# EAGLE design VIC20_HypExp (EAGLE 9.6.2)
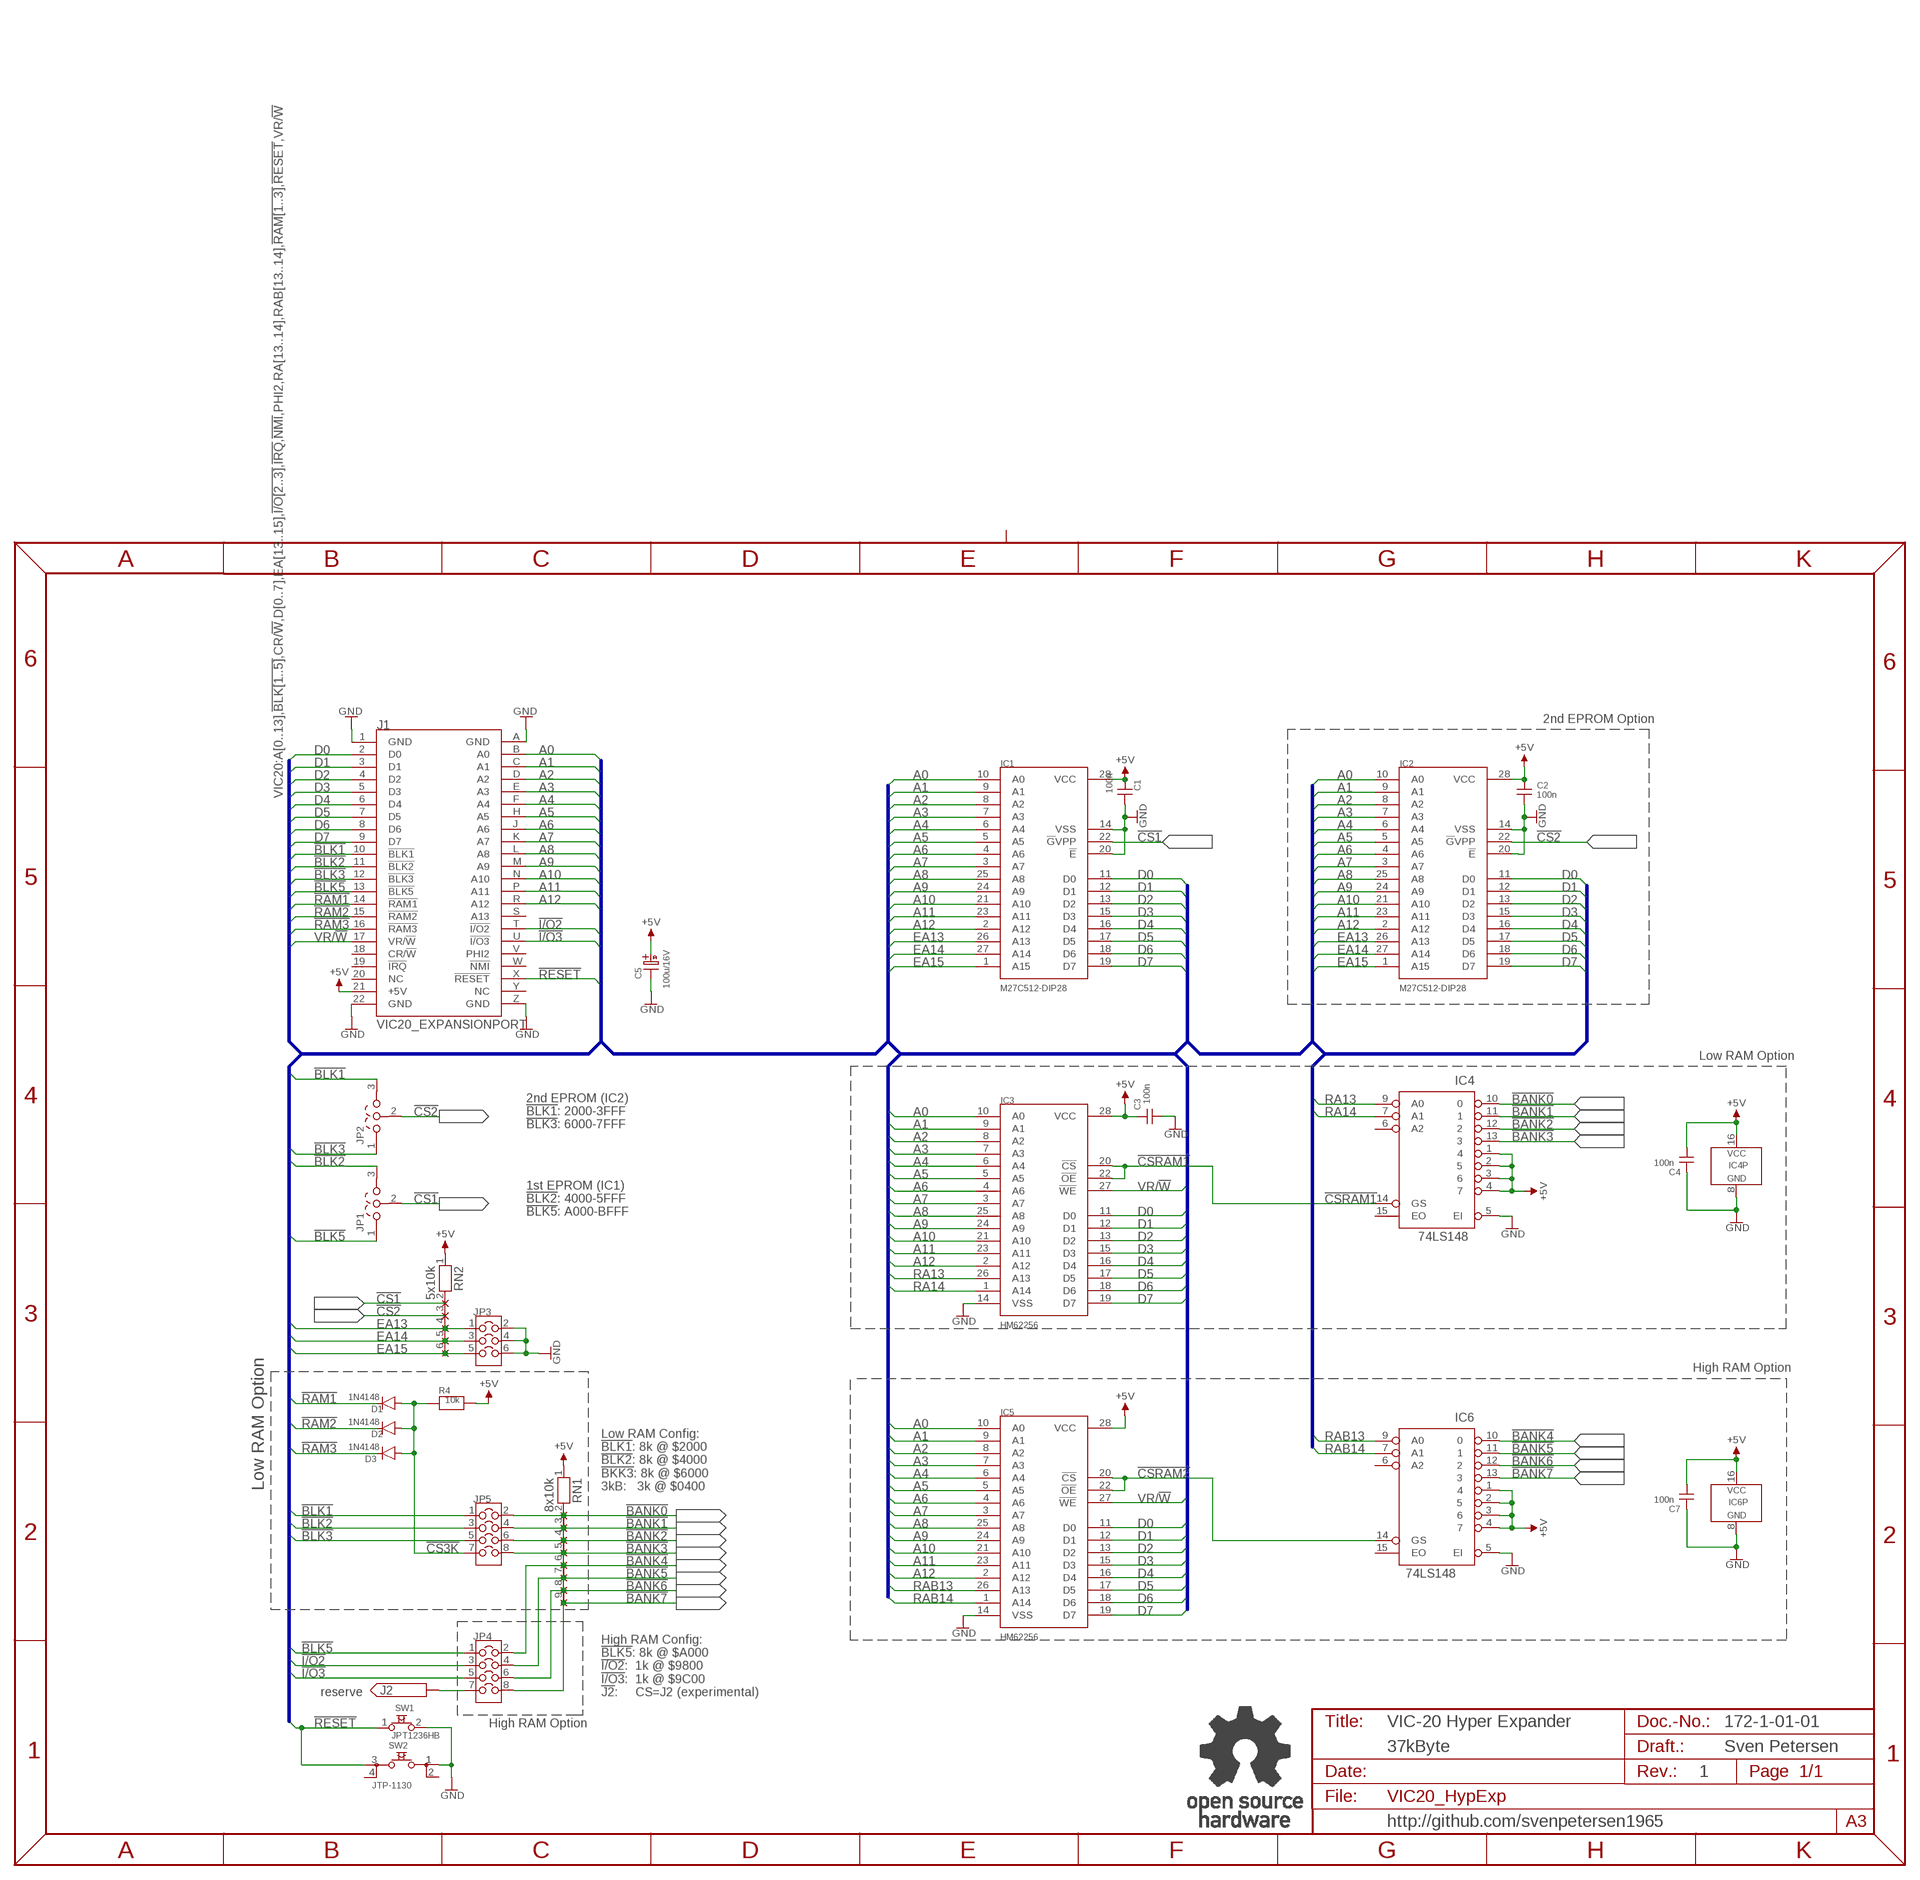
[diagram p0: schematic, sheet 1]

## Parts
C1  100n  CAP01  [C-2,5]
C2  100n  CAP01  [C-2,5]
C3  100n  CAP01  [C-2,5]
C4  100n  CAP01  [C-2,5]
C5  100u/16V  C07/2,5  [C07/2,5]
C7  100n  CAP01  [C-2,5]
D1  1N4148  1N41480.3"  [DO-35/3]
D2  1N4148  1N41480.3"  [DO-35/3]
D3  1N4148  1N41480.3"  [DO-35/3]
IC1  M27C512-DIP28  [DIL28-6]
IC2  M27C512-DIP28  [DIL28-6]
IC3  HM62256  [DIL28-6]
IC4  74LS148  74148DIL  [DIL-16]
IC5  HM62256  [DIL28-6]
IC6  74LS148  74148DIL  [DIL-16]
J1  VIC20_EXPANSIONPORT  [VIC20_EXPANSION]
J2  PINHD-1X1  [1X01]
JP1  COMBI-3P  [COMBI-3P]
JP2  COMBI-3P  [COMBI-3P]
JP3  COMBI-3X2P  [COMBI-3X2]
JP4  COMBI-4X2P  [COMBI-4X2]
JP5  COMBI-4X2P  [COMBI-4X2]
R4  10k  RES04  [R-10]
RN1  8x10k  RN08  [RN-9]
RN2  5x10k  RN05  [RN-6]
SW1  JPT1236HB  [JTP_1236HB]
SW2  JTP-1130  [JTP-1130]
U$2  OPEN_SOURCE_HW  [OPENHW]

## Nets
!BANK0: IC4.10 JP5.2 RN1.2
!BANK1: IC4.11 JP5.4 RN1.3
!BANK2: IC4.12 JP5.6 RN1.4
!BANK3: IC4.13 JP5.8 RN1.5
!BANK4: IC6.10 JP4.2 RN1.6
!BANK5: IC6.11 JP4.4 RN1.7
!BANK6: IC6.12 JP4.6 RN1.8
!BANK7: IC6.13 JP4.8 RN1.9
!BLK1: J1.10(!BLK1) JP2.3 JP5.1
!BLK2: J1.11(!BLK2) JP1.3 JP5.3
!BLK3: J1.12(!BLK3) JP2.1 JP5.5
!BLK5: J1.13(!BLK5) JP1.1 JP4.1
!CS1: IC1.22(!G!VPP) JP1.2 RN2.2
!CS2: IC2.22(!G!VPP) JP2.2 RN2.3
!CS3K: D1.A D2.A D3.A JP5.7 R4.1
!CSRAM1: IC3.20(!CS) IC3.22(!OE) IC4.14(GS)
!CSRAM2: IC5.20(!CS) IC5.22(!OE) IC6.14(GS)
!I/O2: J1.T(!I/O2) JP4.3
!I/O3: J1.U(!I/O3) JP4.5
!RAM1: D1.K J1.14(!RAM1)
!RAM2: D2.K J1.15(!RAM2)
!RAM3: D3.K J1.16(!RAM3)
!RESET: J1.X(!RESET) SW1.1 SW2.3
+5V: C1.1 C2.1 C3.2 C4.1 C5.A(+) C7.1 IC1.28(VCC) IC2.28(VCC) IC3.28(VCC) IC4.1 IC4.2 IC4.3 IC4.4 IC4.16(VCC) IC5.28(VCC) IC6.1 IC6.2 IC6.3 IC6.4 IC6.16(VCC) J1.21(+5V) R4.2 RN1.1 RN2.1
A0: IC1.10(A0) IC2.10(A0) IC3.10(A0) IC5.10(A0) J1.B(A0)
A1: IC1.9(A1) IC2.9(A1) IC3.9(A1) IC5.9(A1) J1.C(A1)
A2: IC1.8(A2) IC2.8(A2) IC3.8(A2) IC5.8(A2) J1.D(A2)
A3: IC1.7(A3) IC2.7(A3) IC3.7(A3) IC5.7(A3) J1.E(A3)
A4: IC1.6(A4) IC2.6(A4) IC3.6(A4) IC5.6(A4) J1.F(A4)
A5: IC1.5(A5) IC2.5(A5) IC3.5(A5) IC5.5(A5) J1.H(A5)
A6: IC1.4(A6) IC2.4(A6) IC3.4(A6) IC5.4(A6) J1.J(A6)
A7: IC1.3(A7) IC2.3(A7) IC3.3(A7) IC5.3(A7) J1.K(A7)
A8: IC1.25(A8) IC2.25(A8) IC3.25(A8) IC5.25(A8) J1.L(A8)
A9: IC1.24(A9) IC2.24(A9) IC3.24(A9) IC5.24(A9) J1.M(A9)
A10: IC1.21(A10) IC2.21(A10) IC3.21(A10) IC5.21(A10) J1.N(A10)
A11: IC1.23(A11) IC2.23(A11) IC3.23(A11) IC5.23(A11) J1.P(A11)
A12: IC1.2(A12) IC2.2(A12) IC3.2(A12) IC5.2(A12) J1.R(A12)
D0: IC1.11(D0) IC2.11(D0) IC3.11(D0) IC5.11(D0) J1.2(D0)
D1: IC1.12(D1) IC2.12(D1) IC3.12(D1) IC5.12(D1) J1.3(D1)
D2: IC1.13(D2) IC2.13(D2) IC3.13(D2) IC5.13(D2) J1.4(D2)
D3: IC1.15(D3) IC2.15(D3) IC3.15(D3) IC5.15(D3) J1.5(D3)
D4: IC1.16(D4) IC2.16(D4) IC3.16(D4) IC5.16(D4) J1.6(D4)
D5: IC1.17(D5) IC2.17(D5) IC3.17(D5) IC5.17(D5) J1.7(D5)
D6: IC1.18(D6) IC2.18(D6) IC3.18(D6) IC5.18(D6) J1.8(D6)
D7: IC1.19(D7) IC2.19(D7) IC3.19(D7) IC5.19(D7) J1.9(D7)
EA13: IC1.26(A13) IC2.26(A13) JP3.1 RN2.4
EA14: IC1.27(A14) IC2.27(A14) JP3.3 RN2.5
EA15: IC1.1(A15) IC2.1(A15) JP3.5 RN2.6
GND: C1.2 C2.2 C3.1 C4.2 C5.K(-) C7.2 IC1.14(VSS) IC1.20(!E) IC2.14(VSS) IC2.20(!E) IC3.14(VSS) IC4.5(EI) IC4.8(GND) IC5.14(VSS) IC6.5(EI) IC6.8(GND) J1.1(GND) J1.22(GND) J1.A(GND) J1.Z(GND) JP3.2 JP3.4 JP3.6 SW1.2 SW2.1
N$1: J2.1 JP4.7
RA13: IC3.26(A13) IC4.9(A0)
RA14: IC3.1(A14) IC4.7(A1)
RAB13: IC5.26(A13) IC6.9(A0)
RAB14: IC5.1(A14) IC6.7(A1)
VR/!W: IC3.27(!WE) IC5.27(!WE) J1.17(VR/!W)
Unconnected: IC4.6(A2) IC4.15(EO) IC6.6(A2) IC6.15(EO) J1.18(CR/!W) J1.19(!IRQ) J1.S(A13) J1.V(PHI2) J1.W(!NMI) J1.Y(NC) SW2.2 SW2.4

## Buses
VIC20:A[0..13],!BLK[1..5],CR/!W,D[0..7],EA[13..15],!I/O[2..3],!IRQ,!NMI,PHI2,RA[13..14],RAB[13..14],!RAM[1..3],!RESET,VR/!W

## Notes on the sheet
- 2nd EPROM Option
- Low RAM Option
- 2nd EPROM (IC2)
  !BLK1!: 2000-3FFF
  !BLK3!: 6000-7FFF
- 1st EPROM (IC1)
  !BLK2!: 4000-5FFF
  !BLK5!: A000-BFFF
- High RAM Option
- Low RAM Option
- Low RAM Config:
  !BLK1!: 8k @ $2000
  !BLK2!: 8k @ $4000
  !BKK3!: 8k @ $6000
  3kB:   3k @ $0400
- reserve
- High RAM Config:
  !BLK5!: 8k @ $A000
  !I/O2!:  1k @ $9800
  !I/O3!:  1k @ $9C00
  !J2!:     CS=J2 (experimental)
- High RAM Option | VIC-20 Hyper Expander | 172-1-01-01
- 37kByte | Sven Petersen
- 1
- http://github.com/svenpetersen1965

## Power pins joined to a net without a drawn wire
NC: J1.20(NC)

## Library data of the parts
C1-C4 C7 = DISCRETE:CAP01
C5 = ELCO:C07/2,5
D1-D3 = Dioden:1N4148
IC1 IC2 = ST:M27C512
IC3 IC5 = Hitachi:HM62256
IC4 IC6 = 74XX:74148
J1 = Commodore:VIC20_EXPANSIONPORT
J2 = PINHEAD:PINHD-1X1
JP1 JP2 = Cutpad:COMBI-3P
JP3 = Cutpad:COMBI-3X2P
JP4 JP5 = Cutpad:COMBI-4X2P
R4 = DISCRETE:RES04
RN1 = DISCRETE:RN08
RN2 = DISCRETE:RN05
SW1 = Namae_Electronics:JPT1236HB
SW2 = Namae_Electronics:JTP-1130
U$2 = Logo:OPEN_SOURCE_HW

## Board
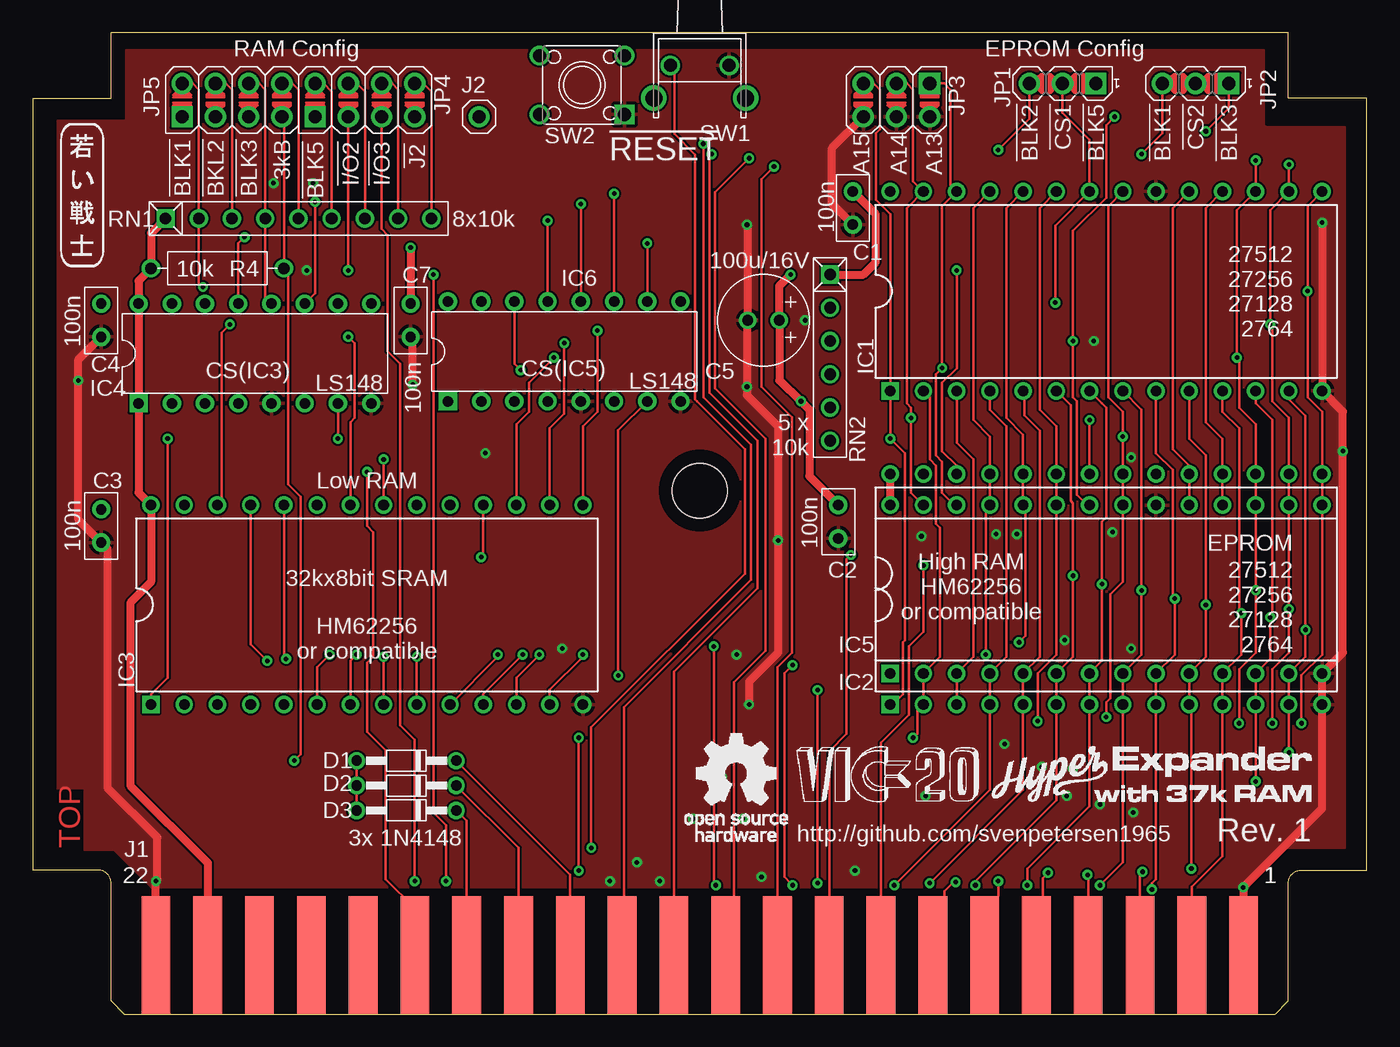
[diagram p1: board, top side]
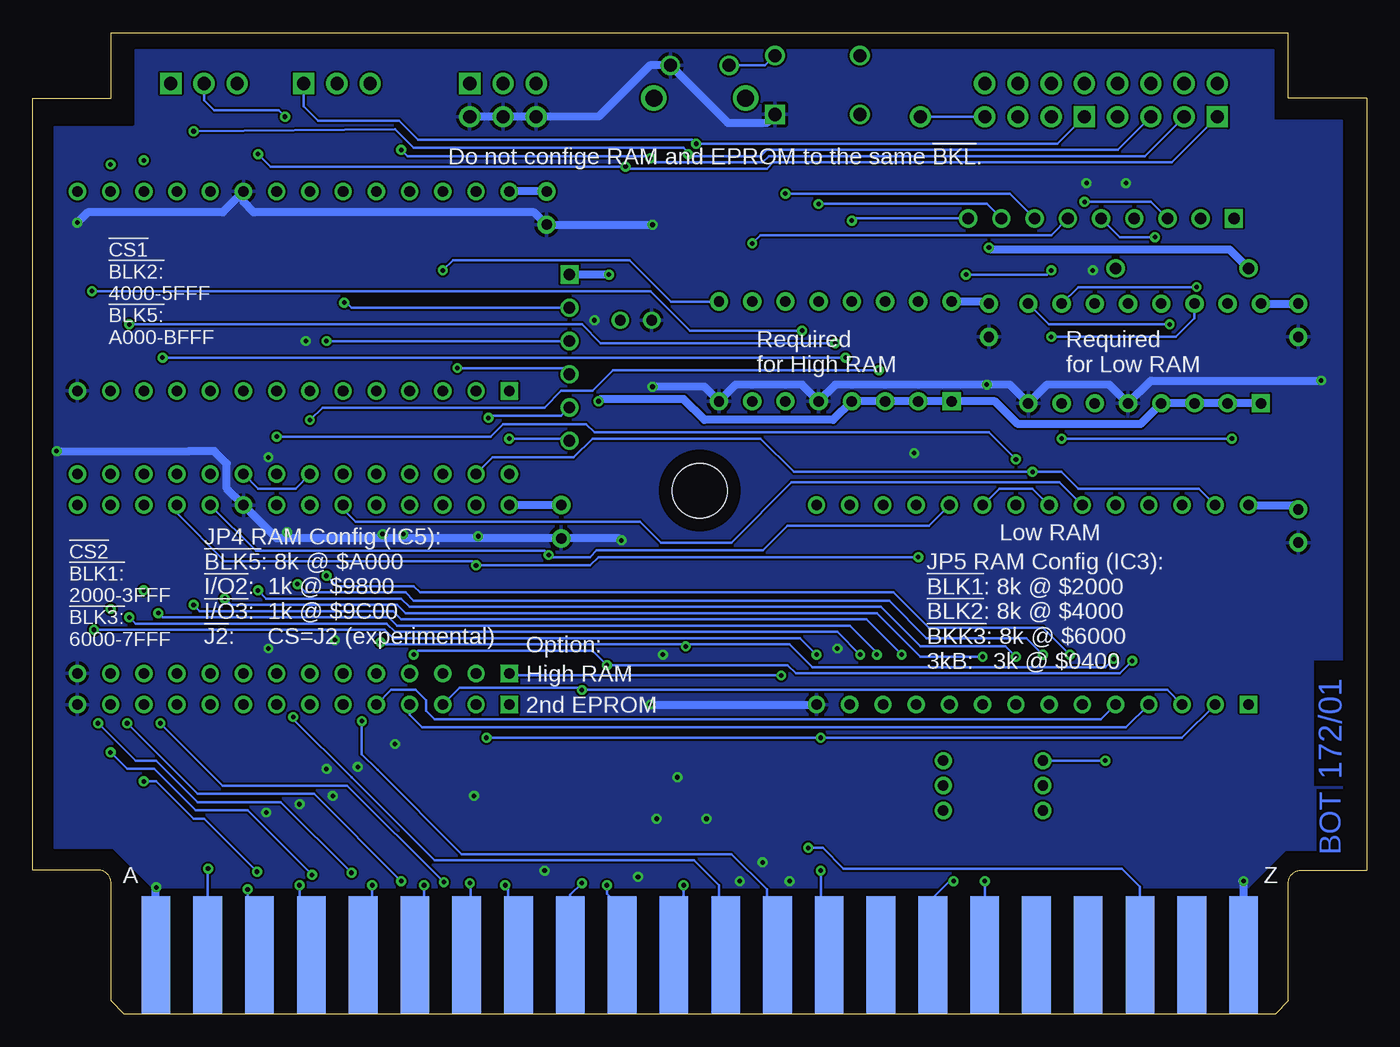
[diagram p2: board, bottom side, seen from below]

Size 102 x 75 mm. Coordinates in mm from the lower left corner, seen from the top.
Outline: 102,11 102,70 96,70 96,75 6,75 6,70 0,70 0,11
Copper layers (1*16): Top 0.035mm / dielectric 1.5mm / Bottom 0.035mm
Design rules "default *": minimum track width 6mil, minimum drill 0.35mm, track to track 6mil, track to pad 6mil, pad to pad 6mil, via to via 6mil, smd to smd 6mil, copper to edge 40mil, drill to drill 6mil, minimum pad ring 10mil, minimum via ring 8mil, stop-mask expansion 4mil, vias tented up to drill 23mil, thermal gap 10mil
Holes 4.2 mm at 51,40
bRestrict: 3 lines

### Footprints (pad centres in the part's own frame; a part is rotated, then mirrored left to right if it is on the bottom)
C-2,5 = drill 0.8 pad 1.397: 1 -1.27,0; 2 1.27,0
C07/2,5 = drill 0.813 pad 1.27: A -1.202,0; K 1.202,0
DO-35/3 = drill 0.8: A -3.81,0; K 3.81,0
DIL28-6 = drill 0.813 square: 1 -16.51,-7.62 | drill 0.813: 2 -13.97,-7.62; 3 -11.43,-7.62; 4 -8.89,-7.62; 5 -6.35,-7.62; 6 -3.81,-7.62; 7 -1.27,-7.62; 8 1.27,-7.62; 9 3.81,-7.62; 10 6.35,-7.62; 11 8.89,-7.62; 12 11.43,-7.62; 13 13.97,-7.62; 14 16.51,-7.62; 15 16.51,7.62; 16 13.97,7.62; 17 11.43,7.62; 18 8.89,7.62; 19 6.35,7.62; 20 3.81,7.62; 21 1.27,7.62; 22 -1.27,7.62; 23 -3.81,7.62; 24 -6.35,7.62; 25 -8.89,7.62; 26 -11.43,7.62; 27 -13.97,7.62; 28 -16.51,7.62
DIL-16 = drill 0.8 pad 1.397 square: 1 -8.89,-3.81 | drill 0.8 pad 1.397: 2 -6.35,-3.81; 3 -3.81,-3.81; 4 -1.27,-3.81; 5 1.27,-3.81; 6 3.81,-3.81; 7 6.35,-3.81; 8 8.89,-3.81; 9 8.89,3.81; 10 6.35,3.81; 11 3.81,3.81; 12 1.27,3.81; 13 -1.27,3.81; 14 -3.81,3.81; 15 -6.35,3.81; 16 -8.89,3.81
VIC20_EXPANSION = smd 2.2 x 9: 1 41.58,4.5; 2 37.62,4.5; 3 33.66,4.5; 4 29.7,4.5; 5 25.74,4.5; 6 21.78,4.5; 7 17.82,4.5; 8 13.86,4.5; 9 9.9,4.5; 10 5.94,4.5; 11 1.98,4.5; 12 -1.98,4.5; 13 -5.94,4.5; 14 -9.9,4.5; 15 -13.86,4.5; 16 -17.82,4.5; 17 -21.78,4.5; 18 -25.74,4.5; 19 -29.7,4.5; 20 -33.66,4.5; 21 -37.62,4.5; 22 -41.58,4.5 | smd 2.2 x 9 bottom: A 41.58,4.5; B 37.62,4.5; C 33.66,4.5; D 29.7,4.5; E 25.74,4.5; F 21.78,4.5; H 17.82,4.5; J 13.86,4.5; K 9.9,4.5; L 5.94,4.5; M 1.98,4.5; N -1.98,4.5; P -5.94,4.5; R -9.9,4.5; S -13.86,4.5; T -17.82,4.5; U -21.78,4.5; V -25.74,4.5; W -29.7,4.5; X -33.66,4.5; Y -37.62,4.5; Z -41.58,4.5
1X01 = drill 1 pad 1.626: 1 0,0
COMBI-3P = drill 1 pad 1.626 square: 1 -2.54,0 | drill 1 pad 1.626: 2 0,0; 3 2.54,0
COMBI-3X2 = drill 1 pad 1.626 square: 1 -1.27,2.54 | drill 1 pad 1.626: 2 1.27,2.54; 3 -1.27,0; 4 1.27,0; 5 -1.27,-2.54; 6 1.27,-2.54
COMBI-4X2 = drill 1 pad 1.626 square: 1 -1.27,3.81 | drill 1 pad 1.626: 2 1.27,3.81; 3 -1.27,1.27; 4 1.27,1.27; 5 -1.27,-1.27; 6 1.27,-1.27; 7 -1.27,-3.81; 8 1.27,-3.81
R-10 = drill 0.889 pad 1.397: 1 -5.08,0; 2 5.08,0
RN-9 = drill 0.889 pad 1.397 square: 1 -10.16,0 | drill 0.889 pad 1.397: 2 -7.62,0; 3 -5.08,0; 4 -2.54,0; 5 0,0; 6 2.54,0; 7 5.08,0; 8 7.62,0; 9 10.16,0
RN-6 = drill 0.889 pad 1.397 square: 1 -6.35,0 | drill 0.889 pad 1.397: 2 -3.81,0; 3 -1.27,0; 4 1.27,0; 5 3.81,0; 6 6.35,0
JTP_1236HB = drill 1: 1 2.25,0; 2 -2.25,0 | drill 1.3: CS1 3.5,2.5; CS2 -3.5,2.5
JTP-1130 = drill 1 square: 1 3.25,-2.25 | drill 1: 2 -3.25,-2.25; 3 3.25,2.25; 4 -3.25,2.25

### Placement (x,y rotation side)
C1  62.71,61.59 270 top
C2  61.59,37.62 270 top
C3  5.24,37.31 90 top
C4  5.24,53.02 270 top
C5  55.88,53.02 180 top
C7  28.89,53.02 270 top
D1  28.57,19.37 0 top
D2  28.57,17.46 0 top
D3  28.57,15.56 0 top
IC1  82.07,55.24 0 top
IC2  82.07,31.27 0 top
IC3  25.56,31.27 0 top
IC4  16.99,50.48 0 top
IC5  82.07,33.66 0 top
IC6  40.64,50.64 0 top
J1  51,0 0 top
J2  34.13,68.58 0 top
JP1  78.74,71.12 180 top
JP2  88.9,71.12 180 top
JP3  66.04,69.85 270 top
JP4  25.4,69.85 90 top
JP5  15.24,69.85 90 top
R4  14.13,56.99 180 top
RN1  20.32,60.8 0 top
RN2  60.96,50.16 270 top
SW1  51,72.5 180 top
SW2  42,71 0 top
U$2  49.85,13.18 0 top
U$15  [SVEN_TAG]  3.81,62.71 0 top
U$16  [2LAYER]  3.65,12.7 90 top
U$40  [PCB-TITLE/]  0,87 0 top  (outside the outline)
U$42  [VIC-20]  58.42,16.19 0 top
U$58  [HYPER_EXPANDER]  73.34,16.19 0 top

### Tracks (layer width: path | path; a pad name or v marks a point on that pad's centre or on a via)
!BANK0  (via drill 0.35)
  Top 0.203: JP5.2 12.22,71.12 12.7,70.64 RN1.2 12.7,55.88 v13.02,55.56
  Bottom 0.203: v13.02,55.56 22.07,55.56 IC4.10
!BANK1  (via drill 0.35)
  Top 0.203: JP5.4 14.76,71.12 15.24,70.64 RN1.3 | v21.59,62.07 21.59,55.09 IC4.11
  Bottom 0.203: RN1.3 16.51,62.07 v21.59,62.07
!BANK2
  Top 0.203: JP5.6 17.3,71.12 17.78,70.64 RN1.4 17.78,54.77 IC4.12
!BANK3  (via drill 0.35)
  Top 0.203: JP5.8 19.84,71.12 20.32,70.64 RN1.5 | v16.19,59.37 15.72,58.9 IC4.13
  Bottom 0.203: RN1.5 18.89,59.37 v16.19,59.37
!BANK4  (via drill 0.35)
  Top 0.203: JP4.2 22.23,71.12 22.86,70.48 RN1.6 | v46.99,58.9 IC6.10
  Bottom 0.203: RN1.6 24.13,59.53 46.35,59.53 v46.99,58.9
!BANK5  (via drill 0.35)
  Top 0.203: JP4.4 24.77,71.12 25.4,70.48 RN1.7 | v44.45,62.71 IC6.11
  Bottom 0.203: RN1.7 27.3,62.71 v44.45,62.71
!BANK6  (via drill 0.35)
  Top 0.203: JP4.6 27.46,71.12 27.94,70.64 RN1.8 | v41.91,61.91 IC6.12
  Bottom 0.203: RN1.8 29.05,61.91 v41.91,61.91
!BANK7  (via drill 0.35)
  Top 0.203: JP4.8 29.84,71.12 30.48,70.48 RN1.9 | v39.37,60.64 IC6.13
  Bottom 0.203: RN1.9 39.21,60.8 v39.37,60.64
!BLK1  (via drill 0.35)
  Top 0.203: J1.10 56.94,26.51 58.05,27.62 58.05,45.61 55.72,47.94 55.72,63.82 v56.67,64.77 | v84.77,65.72 86.36,67.31 JP2.3
  Bottom 0.203: v84.77,65.72 83.82,64.77 v56.67,64.77 56.52,64.61 45.88,64.61 45.4,65.09 14.92,65.09 JP5.1
!BLK2  (via drill 0.35)
  Top 0.203: J1.11 53.62,5.13 53.62,25.36 56.04,27.78 56.04,43.97 52.18,47.84 52.18,62.81 v54.77,65.41 | v73.82,66.04 76.2,68.42 JP1.3
  Bottom 0.203: v73.82,66.04 73.34,65.56 54.93,65.56 v54.77,65.41 54.45,65.09 46.2,65.09 45.72,65.56 16.99,65.56 JP5.3
!BLK3  (via drill 0.35)
  Top 0.203: J1.12 49.02,26.16 55.4,32.54 55.4,43.81 51.75,47.47 51.75,65.56 v51.91,65.72 | v89.69,67.47 91.44,69.22 JP2.1
  Bottom 0.203: v89.69,67.47 74.3,67.63 72.87,66.2 52.23,66.2 51.91,65.88 v51.91,65.72 51.75,65.56 46.35,65.56 45.88,66.04 19.05,66.04 JP5.5
!BLK5  (via drill 0.35)
  Top 0.203: J1.13 45.2,4.64 45.2,23.46 54.93,33.18 54.93,43.5 51.28,47.15 v51.28,66.52
  Bottom 0.203: JP1.1 81.28,69.37 80.17,68.26 73.98,68.26 72.55,66.83 51.59,66.83 v51.28,66.52 45.4,66.52 23.65,66.52 JP4.1
!CS1  (via drill 0.35)
  Top 0.203: JP1.2 78.74,68.9 80.8,66.83 IC1.22 78.18,60.25 v78.18,54.37
  Bottom 0.203: RN2.2 77.63,53.98 78.11,54.45 v78.18,54.37
!CS2  (via drill 0.35)
  Top 0.203: IC2.22 80.64,38.89 79.85,39.69 79.85,42.23 79.85,46.83 79.53,47.15 v79.53,51.44 79.53,59.85 82.07,62.39 82.07,67.94 v82.71,68.58
  Bottom 0.203: v82.71,68.58 83.19,69.06 88.11,69.06 88.9,69.85 JP2.2 | RN2.3 v79.53,51.44
!CS3K  (via drill 0.35)
  Top 0.203: JP5.7 19.21,68.42 R4.1 19.53,56.67 19.53,40.48 20.48,39.53 20.48,19.84 v20,19.37 | D3.A D2.A D1.A
  Bottom 0.203: v20,19.37 D1.A
!CSRAM1  (via drill 0.35)
  Top 0.203: IC3.22 24.29,45.24 24.61,45.56 24.61,51.28 v24.13,51.75
  Bottom 0.203: IC3.22 25.56,40.16 28.1,40.16 IC3.20 | v24.13,51.75 14.61,51.75 13.18,53.18 IC4.14
!CSRAM2  (via drill 0.35)
  Top 0.203: IC6.14 36.83,49.69 v37.31,49.21 | v80.8,45.4 IC5.22
  Bottom 0.203: IC5.20 84.77,40.16 81.92,40.16 IC5.22 | v37.31,49.21 57.63,49.21 59.21,47.62 61.59,47.62 62.87,46.35 70.8,46.35 79.85,46.35 v80.8,45.4
!I/O2  (via drill 0.35)
  Top 0.203: v31.59,10.16 31.59,14.45 30.64,15.4 v30.64,56.52 | v24.13,56.83 JP4.3
  Bottom 0.203: J1.T 33.18,8.89 31.91,10.16 v31.59,10.16 | v30.64,56.52 24.45,56.52 v24.13,56.83
!I/O3  (via drill 0.35)
  Top 0.203: v29.21,10.16 29.21,20.95 28.1,22.07 28.1,49.69 27.15,50.64 27.15,59.53 26.67,60.01 JP4.5
  Bottom 0.203: J1.U v29.21,10.16
!RAM1
  Top 0.203: D1.K 41.1,10.65 J1.14
!RAM2
  Top 0.203: D2.K 37.14,12.71 J1.15
!RAM3
  Top 0.203: D3.K 33.18,14.76 J1.16
!RESET  (via drill 0.35)
  Top 0.203: v42.7,12.7 42.7,21.91 54.45,33.66 54.45,43.18 50.79,46.84 50.64,46.99 50.64,65.69 49.07,67.26 49.07,72.18 SW1.1
  Bottom 0.203: J1.X 17.34,9.72 18.73,11.11 40.01,11.11 41.59,12.7 v42.7,12.7 | SW1.1 46,72.5 SW2.3
+5V  (via drill 0.35)
  Top 0.61: IC2.28 IC5.28 | RN1.1 9.05,59.69 R4.2 8.1,56.04 IC4.16 IC4.1 8.1,39.85 IC3.28 9.05,33.02 7.46,31.43 7.46,17.46 13.38,11.54 J1.21 | v57.94,56.52 57.08,55.65 C5.A 57.08,48.42 57.15,48.42 v58.74,46.83 59.37,46.2 59.37,41.12 C2.1 | RN2.1 63.5,56.52 64.45,57.47 64.45,61.12 C1.1 | v28.89,58.58 C7.1
  Bottom 0.61: C1.1 IC1.28 | C2.1 IC2.28 | IC4.16 C4.1 | IC3.28 5.56,38.89 C3.2 | IC4.1 IC4.2 IC4.3 IC4.4 17.3,45.09 26.67,45.09 28.42,46.83 IC6.1 IC6.2 IC6.3 IC6.4 40.8,45.4 50.64,45.4 52.23,46.99 58.58,46.99 v58.74,46.83 | v57.94,56.52 RN2.1 | R4.2 10.48,58.42 28.73,58.42 v28.89,58.58 | C7.1 29.05,54.45 IC6.16
A0  (via drill 0.35)
  Top 0.203: IC1.10 88.42,43.97 89.69,42.7 v89.69,31.27 89.69,27.3 IC5.10 IC2.10 88.58,23.5 v88.58,11.11 | IC3.10 35.56,27.3 v35.56,27.46
  Bottom 0.203: J1.B 88.62,11.07 v88.58,11.11 | v35.56,27.46 38.26,30.16 51.75,30.16 73.82,30.16 74.45,30.8 89.22,30.8 v89.69,31.27
A1  (via drill 0.35)
  Top 0.203: IC1.9 85.88,42.86 87.15,41.59 87.15,31.91 v87.31,31.75 87.31,27.46 IC5.9 IC2.9 85.88,10.32 85.57,10 v85.57,9.53 | IC3.9 v29.37,27.3
  Bottom 0.203: v85.57,9.53 85.57,5.41 J1.C | v87.31,31.75 86.84,31.27 74.14,31.27 73.5,30.64 51.59,30.64 37.47,30.64 34.13,27.3 v29.37,27.3
A2  (via drill 0.35)
  Top 0.203: IC1.8 84.77,46.2 v84.77,32.38 84.77,27.46 IC5.8 IC2.8 83.34,11.59 v81.6,9.84 | IC3.8 v26.83,27.3
  Bottom 0.203: v81.6,9.84 81.6,5.4 J1.D | v26.83,27.3 27.62,28.1 34.13,28.1 37.15,31.11 73.18,31.11 73.82,31.75 84.14,31.75 v84.77,32.38
A3  (via drill 0.35)
  Top 0.203: IC1.7 81.76,46.67 82.07,46.35 82.07,37.94 81.76,37.62 v81.76,32.86 81.76,26.99 IC5.7 IC2.7 80.8,15.88 76.04,11.11 v76.04,9.84 | v24.77,27.46 24.29,26.99 IC3.7
  Bottom 0.203: v76.04,9.84 76.04,5.2 J1.E | v24.77,27.46 26.04,28.73 33.66,28.73 36.51,31.59 72.87,31.59 73.5,32.23 81.12,32.23 v81.76,32.86
A4  (via drill 0.35)
  Top 0.203: IC1.6 79.38,46.51 79.38,39.21 79.53,39.05 v79.53,33.5 79.53,27.3 IC5.6 IC2.6 78.26,16.35 72.07,10.16 v72.07,9.84 | v22.7,27.46 21.75,26.51 IC3.6
  Bottom 0.203: J1.F 72.07,5.21 v72.07,9.84 | v22.7,27.46 24.77,29.53 33.5,29.53 36.2,32.23 72.39,32.23 72.87,32.7 78.74,32.7 v79.53,33.5
A5  (via drill 0.35)
  Top 0.203: IC1.5 75.8,47.55 75.8,45.77 76.99,44.58 76.99,27.3 IC5.5 IC2.5 75.72,17.14 v68.58,10
  Bottom 0.203: J1.H 68.5,4.82 68.5,9.92 v68.58,10 | IC3.5 20.32,22.54 71.28,22.54 71.91,23.18 71.91,23.97 72.71,24.77 74.61,24.77 IC2.5
A6  (via drill 0.35)
  Top 0.203: IC1.4 73.18,46.2 74.45,44.93 74.45,27.3 IC5.4 IC2.4 73.18,17.14 v65.88,9.84
  Bottom 0.203: v65.88,9.84 65.65,9.62 65.65,5.29 J1.J | IC3.4 18.41,21.91 72.23,21.91 73.18,22.86 IC2.4
A7  (via drill 0.35)
  Top 0.203: IC1.3 70.64,43.66 71.91,42.39 71.91,27.3 IC5.3 IC2.3 | v60.01,10 v60.01,24.77
  Bottom 0.203: IC2.3 69.37,24.92 60.33,24.92 60.17,24.77 v60.01,24.77 59.37,24.77 15.24,24.77 IC3.3 | J1.K 60.9,9.11 v60.01,10
A8  (via drill 0.35)
  Top 0.203: IC1.25 71.91,61.59 71.91,57.63 71.91,45.4 73.18,44.13 IC5.25 IC2.25 72.87,38.58 v72.87,27.46 | v58.1,9.84 57.94,10 57.47,10.48 57.47,26.04 v58.1,26.67 | IC3.25 16.67,28.26 v17.94,26.99
  Bottom 0.203: v72.87,27.46 72.55,27.78 59.21,27.78 v58.1,26.67 44.29,26.67 43.66,26.04 18.89,26.04 v17.94,26.99 | J1.L 56.94,8.04 58.1,9.21 v58.1,9.84
A9  (via drill 0.35)
  Top 0.203: IC1.24 74.45,61.59 74.45,57.94 74.45,45.56 75.72,44.29 IC5.24 IC2.24 75.88,38.73 75.88,28.89 v75.41,28.42 | v52.07,28.1 52.07,10 v52.23,9.84 | IC3.24 19.21,27.3 v19.37,27.15
  Bottom 0.203: v75.41,28.42 75.25,28.26 68.1,28.26 52.07,28.26 | v52.07,28.1 52.07,28.26 | J1.M 52.23,5.25 v52.23,9.84 | 52.07,28.26 51.91,28.26 44.13,28.26 42.39,26.51 20,26.51 v19.37,27.15
A10  (via drill 0.35)
  Top 0.203: IC1.21 82.23,61.75 82.23,59.05 82.23,47.15 83.34,46.04 v83.34,44.13 IC5.21 IC2.21 83.34,33.02 82.39,32.07 82.39,24.13 82.07,23.81 v82.07,22.7 | IC3.21 v26.83,42.39
  Bottom 0.203: J1.N 49.53,5.01 49.53,9.84 51.44,11.75 71.28,11.75 77.63,18.1 82.07,22.54 v82.07,22.7 | v26.83,42.39 28.89,44.45 59.05,44.45 59.69,45.09 66.04,45.09 66.99,44.13 v83.34,44.13
A11  (via drill 0.35)
  Top 0.203: IC1.23 76.99,61.59 76.99,58.42 76.99,46.2 78.26,44.93 IC5.23 IC2.23 78.26,27.46 76.83,26.04 v76.83,22.38
  Bottom 0.203: J1.P 45.88,5.32 45.88,9.53 48.58,12.22 69.22,12.22 75.64,18.65 76.83,19.84 v76.83,22.38 | IC3.23 23.5,40.64 43.97,40.64 48.58,36.04 53.98,36.04 55.56,37.62 77.31,37.62 78.26,38.58 IC2.23
A12  (via drill 0.35)
  Top 0.203: IC1.2 68.58,47.15 68.58,42.39 69.06,41.91 69.06,37.47 69.37,37.15 69.37,27.3 IC5.2 IC2.2 67.63,23.18 67.63,21.43 v67.31,21.11 | v41.75,10.95 v41.75,21.11
  Bottom 0.203: J1.R 41.75,5.15 v41.75,10.95 | v67.31,21.11 v41.75,21.11 14.13,21.11 IC3.2
D0  (via drill 0.35)
  Top 0.203: J1.2 88.62,9.72 90.96,12.06 IC2.11 IC5.11 92.39,27.46 v92.39,30.64 92.23,30.8 92.23,44.77 90.96,46.04 IC1.11 | v37.47,27.46 34.45,24.45 IC3.11
  Bottom 0.203: v37.47,27.46 37.39,27.54 39.53,29.69 74.14,29.69 74.77,30.32 92.08,30.32 v92.39,30.64
D1  (via drill 0.35)
  Top 0.203: IC1.12 93.5,46.67 94.77,45.4 94.77,30.48 v94.61,30.32 94.61,27.15 IC5.12 IC2.12 v93.5,17.78 | J1.3 84.66,10.52 84.93,10.79 v84.85,10.87 | v38.73,27.46 36.99,25.72 IC3.12
  Bottom 0.203: v84.85,10.87 88.9,14.92 89.69,14.92 92.55,17.78 v93.5,17.78 | v38.73,27.46 40.48,29.21 74.3,29.21 74.93,29.84 94.14,29.84 v94.61,30.32
D2  (via drill 0.35)
  Top 0.203: IC1.13 96.04,46.99 97.31,45.72 v97.31,29.37 97.31,27.3 IC5.13 IC2.13 96.04,20.16 v96.04,20 | J1.4 80.7,10.58 v80.64,10.64 | IC3.13 39.53,24.77 42.07,27.3 v42.07,27.46
  Bottom 0.203: v80.64,10.64 85.57,15.56 89.53,15.56 92.71,18.73 94.77,18.73 v96.04,20 | v42.07,27.46 43.34,28.73 74.45,28.73 75.09,29.37 v97.31,29.37
D3  (via drill 0.35)
  Top 0.203: IC1.15 97.47,61.75 v97.47,55.24 97.47,47.15 98.58,46.04 IC5.15 IC2.15 98.58,27.46 97,25.88 v97,22.23 | J1.5 77.22,4.98 77.22,10.38 v77.63,10.79 | IC3.15 42.07,44.93 43.18,46.04 v43.18,52.23
  Bottom 0.203: v77.63,10.79 83.03,16.19 89.38,16.19 92.55,19.37 94.14,19.37 v97,22.23 | v43.18,52.23 51.75,52.23 54.77,55.24 v97.47,55.24
D4  (via drill 0.35)
  Top 0.203: J1.6 72.78,8.01 73.82,9.05 v73.82,10.16 | v94.77,22.23 94.77,26.35 96.04,27.62 v96.04,30.96 IC2.16 IC5.16 96.04,45.56 94.77,46.83 94.77,52.55 v94.61,52.7 94.61,61.44 IC1.16 v96.04,64.93 | IC3.16 39.53,44.77 40.64,45.88 v40.64,51.28
  Bottom 0.203: v73.82,10.16 80.49,16.83 89.38,16.83 v94.77,22.23 | v40.64,51.28 58.58,51.28 60.01,52.7 v94.61,52.7
D5  (via drill 0.35)
  Top 0.203: J1.7 69.69,5.37 69.69,9.37 70.48,10.16 v70.56,10.08 | v92.23,22.23 92.23,26.35 93.5,27.62 v93.5,32.38 IC2.17 IC5.17 93.5,45.09 92.23,46.35 92.23,50.01 v92.08,50.16 92.08,61.44 IC1.17 v93.5,65.25 | IC3.17 36.99,45.09 37.94,46.04 37.94,48.26 v39.85,50.16
  Bottom 0.203: v70.56,10.08 77.95,17.46 87.47,17.46 v92.23,22.23 | v39.85,50.16 v92.08,50.16
D6  (via drill 0.35)
  Top 0.203: IC2.18 IC5.18 90.96,43.95 89.69,45.22 89.69,60.33 89.69,61.59 IC1.18 | v68.1,34.29 68.1,29.21 66.99,28.1 66.99,24.13 66.99,22.86 64.86,20.73 J1.8 | IC3.18 34.45,35.24 34.29,35.08 v34.29,34.92
  Bottom 0.203: IC2.18 90.96,38.26 87.31,34.61 68.42,34.61 v68.1,34.29 59.37,34.29 58.74,34.92 v34.29,34.92
D7  (via drill 0.35)
  Top 0.203: IC1.19 87.15,61.59 87.15,59.37 87.15,43.18 88.42,41.91 IC5.19 IC2.19 | J1.9 60.9,20.1 62.23,21.43 62.23,34.77 v62.55,35.08
  Bottom 0.203: IC2.19 84.93,35.4 62.87,35.4 v62.55,35.08 62.55,34.92 59.4,34.92 58.88,35.44 46.16,35.44 44.29,37.31 33.5,37.31 IC3.19
EA13  (via drill 0.35)
  Top 0.203: IC2.26 70.48,38.89 69.53,39.85 69.53,42.23 69.06,42.7 69.06,48.9 v69.53,49.37 69.53,61.75 IC1.26 70.17,63.34 70.17,70.64 69.69,71.12 JP3.1
  Bottom 0.203: RN2.4 61.44,49.37 v69.53,49.37
EA14  (via drill 0.35)
  Top 0.203: JP3.3 66.83,71.12 67.31,70.64 67.31,63.66 IC1.27 66.83,61.59 66.83,46.67 67.15,46.35 v67.15,45.56 67.15,39.85 IC2.27
  Bottom 0.203: RN2.5 61.59,45.72 66.99,45.72 v67.15,45.56
EA15  (via drill 0.35)
  Top 0.203: IC2.1 65.72,23.65 66.52,24.45 66.52,28.42 66.67,28.57 66.67,42.86 v65.56,43.97 IC1.1 65.56,61.12 64.45,62.23 64.45,67.31 64.77,67.63 64.77,70.64 64.29,71.12 JP3.5
  Bottom 0.203: RN2.6 61.12,43.97 v65.56,43.97
GND  (via drill 0.35)
  Top 0.61: C1.2 61.12,61.91 61.12,66.2 JP3.6 | v98.58,60.48 IC1.14 100.17,46.04 v100.17,43.02 100.17,27.62 IC5.14 IC2.14 98.58,15.72 v92.55,9.68 92.55,4.53 J1.A | J1.Z v9.42,10.16 9.53,10.27 9.53,13.49 5.71,17.3 5.71,35.56 C3.1 3.49,37.78 v3.49,48.42 3.49,50.01 C4.2 | v54.61,60.33 54.68,60.26 C5.K 54.61,52.95 v54.61,47.94 54.61,47.31 56.99,44.93 v56.99,36.2 56.99,27.62 54.77,25.4 v54.77,23.65 | v29.05,48.1 29.05,51.59 C7.2
  Bottom 0.61: JP3.2 JP3.4 JP3.6 58.74,68.58 54.82,72.5 SW1.2 48.85,68.1 45.88,68.1 45.25,68.73 SW2.1 | v98.58,60.48 97.79,61.28 87.47,61.28 IC1.20 85.88,62.07 85.09,61.28 63.66,61.28 C1.2 v54.61,60.33 | v100.17,43.02 90.01,43.02 88.11,43.02 87.15,42.07 87.15,40.16 IC2.20 83.34,36.35 C2.2 57.15,36.35 v56.99,36.2 | J1.A 92.58,9.65 v92.55,9.68 | J1.Z 9.42,10.05 9.53,10.16 v9.42,10.16 | v54.61,47.94 50.64,47.94 IC6.8 48.26,48.1 43.18,48.1 IC6.5 40.64,48.1 v29.05,48.1 27.3,48.1 IC4.8 24.45,48.1 19.68,48.1 IC4.5 16.51,48.42 v3.49,48.42 | v54.77,23.65 IC3.14
  other vias: 62.87,10.95 46.2,11.59 84.14,15.4 81.6,16.03 79.06,16.67 77.15,18.89 44.13,10.16 47.94,10.16 79.53,18.73 83.98,42.55 83.98,27.94 50.48,14.92 54.29,14.92 55.72,10.48 59.05,53.02 68.26,16.67 74.3,20.64 52.7,18.1 67.94,36.51 73.66,36.67 82.55,36.83 78.9,28.57 75.25,36.67 81.12,51.44 34.61,42.86 21.43,63.5 20.95,56.83 18.41,63.5 53.82,27.46 40.48,27.94
  pour Top: 1.91,68.26 7.14,68.26 7.14,73.66 94.14,73.66 94.14,67.94 94.3,67.79 100.33,67.79 100.33,12.7 95.89,12.7 95.73,12.86 92.55,9.68 9.05,9.68 6.19,12.54 1.91,12.54
  pour Bottom: 1.91,68.26 7.14,68.26 7.14,73.66 94.14,73.66 94.14,67.94 94.3,67.79 100.33,67.79 100.33,12.7 95.89,12.7 92.87,9.68 91.6,9.68 9.05,9.68 6.19,12.54 1.91,12.54
N$1
  Bottom 0.203: JP4.7 J2.1
RA13  (via drill 0.35)
  Top 0.203: IC3.26 14.45,39.21 14.45,52.07 v15.08,52.7
  Bottom 0.203: v15.08,52.7 24.29,52.7 IC4.9
RA14  (via drill 0.35)
  Top 0.203: IC3.1 9.05,24.45 10.32,25.72 v10.32,43.97 | v23.34,43.97 IC4.7
  Bottom 0.203: v10.32,43.97 v23.34,43.97
RAB13  (via drill 0.35)
  Top 0.203: v70.64,56.83 70.64,49.37 69.53,48.26 69.53,43.02 70.64,41.91 IC5.26
  Bottom 0.203: v70.64,56.83 69.85,57.63 56.36,57.63 53.18,54.45 IC6.9
RAB14  (via drill 0.35)
  Top 0.203: v44.77,25.88 44.77,44.61 IC6.7
  Bottom 0.203: IC5.1 65.41,25.88 59.05,25.88 v44.77,25.88
VR/!W  (via drill 0.35)
  Top 0.203: J1.17 29.22,8.09 26.99,10.32 26.99,20.16 25.56,21.59 25.56,26.83 26.04,27.3 26.04,36.83 25.56,37.31 v25.56,41.43
  Bottom 0.203: IC5.27 66.83,42.55 60.64,42.55 59.21,43.97 50.8,43.97 46.35,43.97 43.81,41.43 v25.56,41.43 23.34,41.43 22.07,40.16 12.86,40.16 IC3.27

### Text on the board
Bottom: 172/01
tPlace: RAM Config | EPROM Config | !BLK2 | !CS1 | !BLK5 | !BLK1 | !CS2 | !BLK3 | !BLK1 | !BKL2 | !BLK3 | 3kB | !BLK5 | !I/O2 | !I/O3 | !J2 | !RESET | A15 | A14 | A13 | 8x10k | 100n | 100u/16V | 10k | 27512 / 27256 / 27128 / 2764 | 100n | CS(IC3) | CS(IC5) | LS148 | LS148 | 100n | 5 x / 10k | Low RAM | 100n | 100n | EPROM | High RAM | 32kx8bit SRAM | 27512 / 27256 / 27128 / 2764 | HM62256 / or compatible | HM62256 / or compatible | 3x 1N4148 | http://github.com/svenpetersen1965 | Rev. 1
bPlace: Do not confige RAM and EPROM to the same !BKL!. | !CS1 / !BLK2: / 4000-5FFF / !BLK5: / A000-BFFF | Required / for Low RAM | Required / for High RAM | Low RAM | Option: | JP4 RAM Config (IC5): / !BLK5!: 8k @ $A000 / !I/O2!: 1k @ $9800 / !I/O3!: 1k @ $9C00 / !J2!: CS=J2 (experimental) | !CS2 / !BLK1: / 2000-3FFF / !BLK3: / 6000-7FFF | JP5 RAM Config (IC3): / !BLK1!: 8k @ $2000 / !BLK2!: 8k @ $4000 / !BKK3!: 8k @ $6000 / 3kB: 3k @ $0400 | High RAM | 2nd EPROM
Document: 172-2-01-01 | Sven Petersen / 2021 | 35µm | 2 | 1